# EAGLE design appleii (EAGLE 9.6.2)
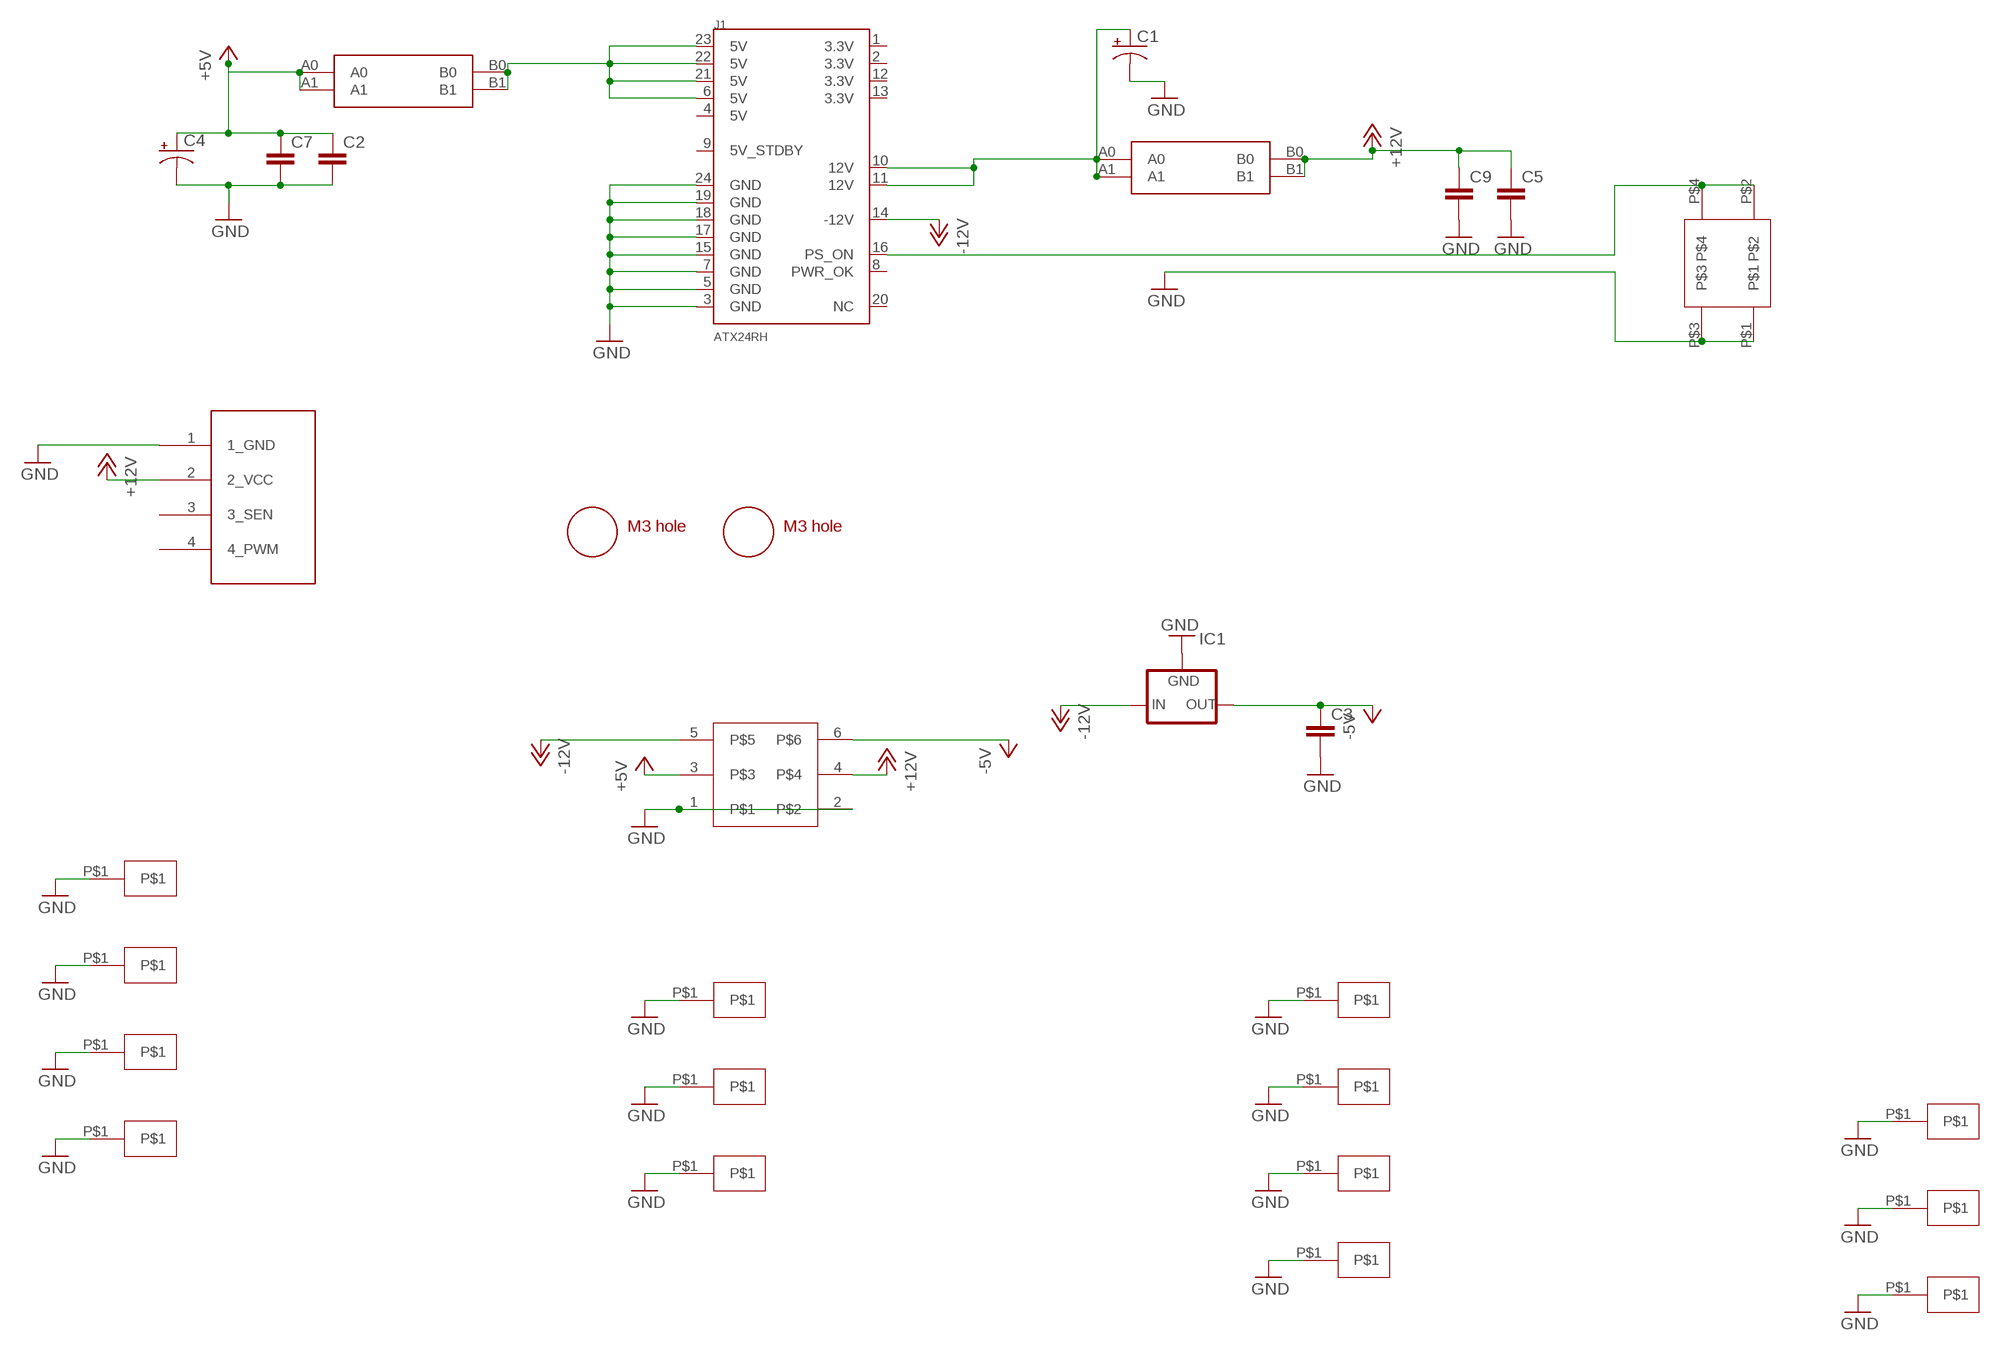
[diagram p0: schematic, sheet 1]

## Parts
C1  CPOL-USE3.5-8  [E3,5-8]
C2  C5/2.5  [C5B2.5]
C3  C5/2.5  [C5B2.5]
C4  CPOL-USE3.5-8  [E3,5-8]
C5  C5/2.5  [C5B2.5]
C7  C5/2.5  [C5B2.5]
C9  C5/2.5  [C5B2.5]
IC1  79XXS  [79XXS]
J1  ATX24RH  [ATX24_RIGHT_ANGLE]
JP3  4PIN_FAN  [1X04]
U$1  CAR_FUSE_HOLDER3IN1  [FUSE_HOLDER_3IN1]
U$2  CAR_FUSE_HOLDER3IN1  [FUSE_HOLDER_3IN1]
U$3  ROCK_SW  [ROCK_SWITCH]
U$4  M3_MOUNTING_HOLE  [M3_MOUNTING_HOLE_PACK]
U$5  M3_MOUNTING_HOLE  [M3_MOUNTING_HOLE_PACK]
U$6  APPLEII  [APPLEII]
U$7  EDGEPAD  [EDGEPAD]
U$8  EDGEPAD  [EDGEPAD]
U$9  EDGEPAD  [EDGEPAD]
U$10  EDGEPAD  [EDGEPAD]
U$11  EDGEPAD  [EDGEPAD]
U$12  EDGEPAD  [EDGEPAD]
U$13  EDGEPAD  [EDGEPAD]
U$14  EDGEPAD  [EDGEPAD]
U$15  EDGEPAD  [EDGEPAD]
U$16  EDGEPAD  [EDGEPAD]
U$17  EDGEPAD  [EDGEPAD]
U$18  EDGEPAD  [EDGEPAD]
U$19  EDGEPAD  [EDGEPAD]
U$20  EDGEPAD  [EDGEPAD]

## Nets
+5V: C2.1 C4.+ C7.1 U$1.A0 U$1.A1 U$6.3
+12V: C5.1 C9.1 JP3.2(2_VCC) U$2.B0 U$2.B1 U$6.4
-5V: C3.1 IC1.OUT U$6.6
-12V: IC1.IN J1.14(-12V) U$6.5
GND: C1.- C2.2 C3.2 C4.- C5.2 C7.2 C9.2 IC1.GND J1.3(GND) J1.5(GND) J1.7(GND) J1.15(GND) J1.17(GND) J1.18(GND) J1.19(GND) J1.24(GND) JP3.1(1_GND) U$3.P$1 U$3.P$3 U$6.1 U$6.2 U$7.P$1 U$8.P$1 U$9.P$1 U$10.P$1 U$11.P$1 U$12.P$1 U$13.P$1 U$14.P$1 U$15.P$1 U$16.P$1 U$17.P$1 U$18.P$1 U$19.P$1 U$20.P$1
N$5: J1.16(PS_ON) U$3.P$2 U$3.P$4
N$6: J1.6(5V) J1.21(5V) J1.22(5V) J1.23(5V) U$1.B0 U$1.B1
N$8: C1.+ J1.10(12V) J1.11(12V) U$2.A0 U$2.A1
Unconnected: J1.1(3.3V) J1.2(3.3V) J1.4(5V) J1.8(PWR_OK) J1.9(5V_STDBY) J1.12(3.3V) J1.13(3.3V) J1.20(NC) JP3.3(3_SEN) JP3.4(4_PWM)

## Library data of the parts
C1 C4 = adafruit_changed:CPOL-US: POLARIZED CAPACITOR, American symbol
C2 C3 C5 C7 C9 = capacitor-wima:C: CAPACITOR naming: grid - package width
IC1 = v-reg:79XXS: VOLTAGE REGULATOR
J1 = macse:ATX24: ATX24 Pin Power Supply Connector This is a good connector for connecting a computer power supply to a PCB. It's massive, but provides many amps of power at 5V and 12V. SKU: PRT-09498
JP3 = appleii:4PIN_FAN: PIN HEADER
U$1 U$2 = atx_power_control:CAR_FUSE_HOLDER
U$3 = atx4vc:ROCK_SW
U$4 U$5 = a:M3_MOUNTING_HOLE
U$6 = atx4vc:APPLEII
U$7-U$20 = atx4vc:EDGEPAD

## Board
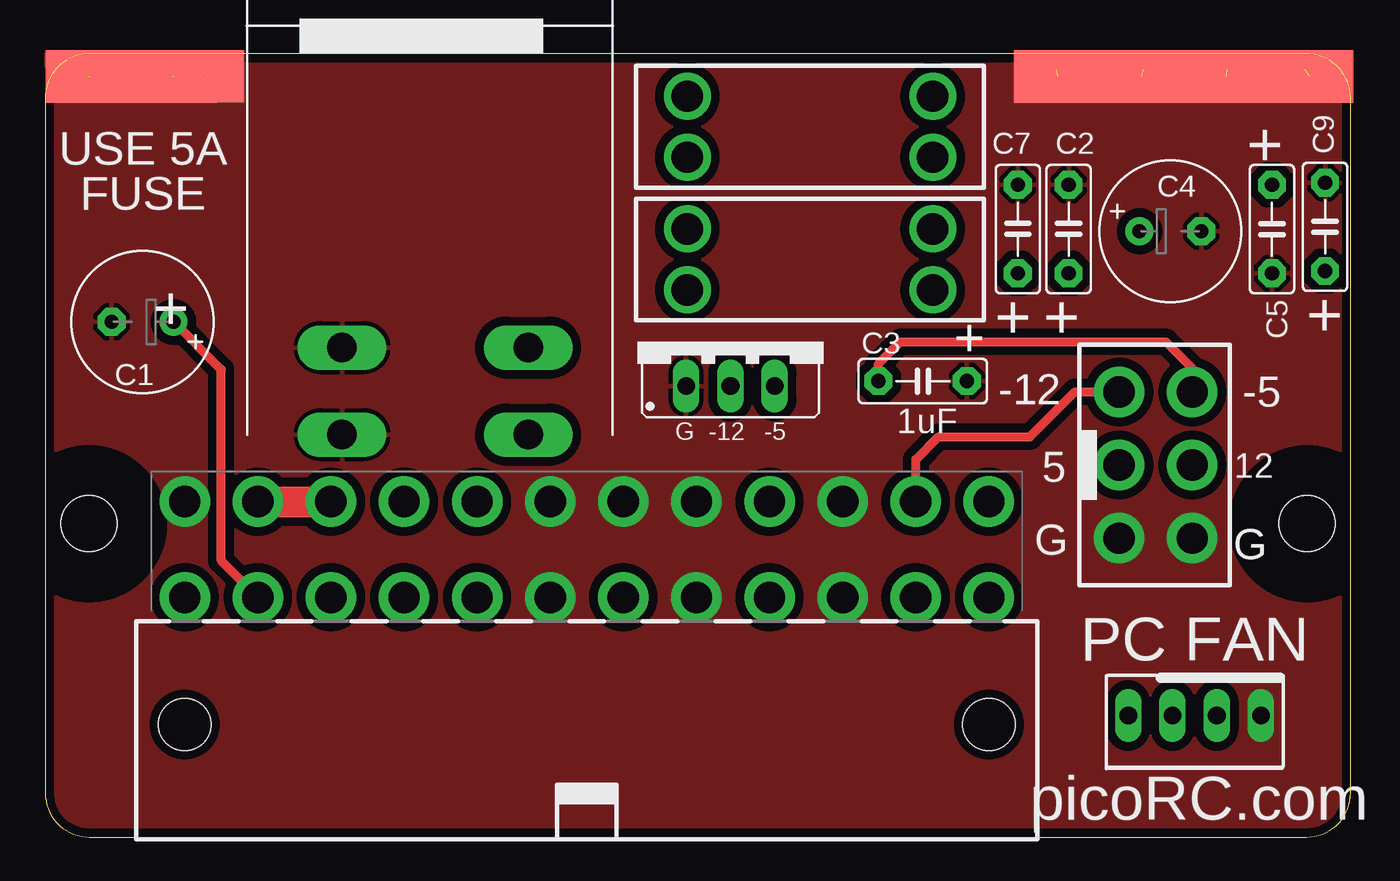
[diagram p1: board, top side]
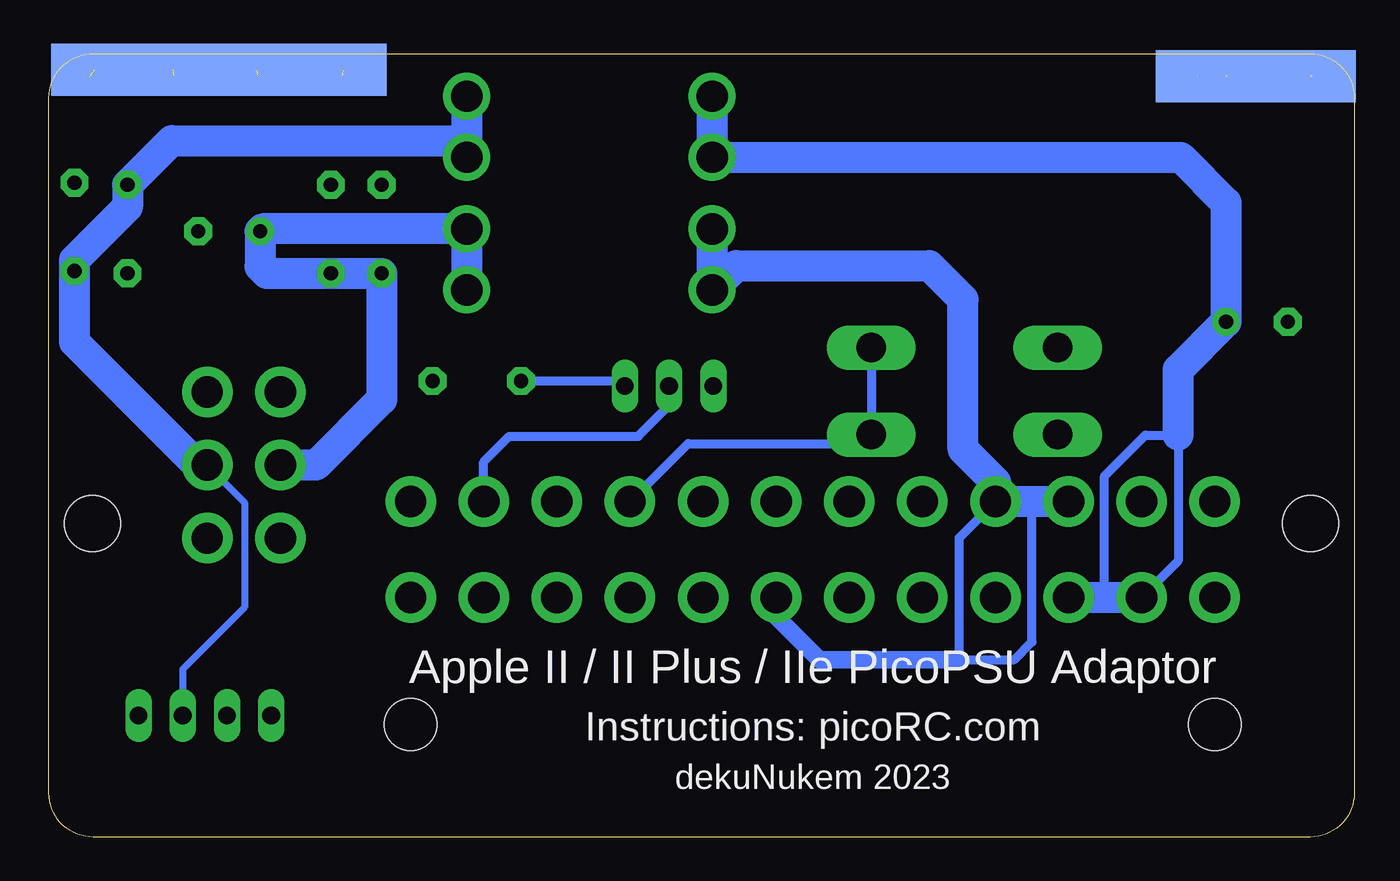
[diagram p2: board, bottom side, seen from below]

Size 75 x 45 mm. Coordinates in mm from the lower left corner, seen from the top.
Outline: 75,2.54 75,42.46 arc90 72.46,45 2.54,45 arc90 0,42.46 0,2.54 arc90 2.54,0 72.46,0 arc90 75,2.54
Copper layers (1*16): Top 0.035mm / dielectric 1.5mm / Bottom 0.035mm
Design rules "deku_2layer_6mil *": minimum track width 6mil, minimum drill 15mil, track to track 20mil, track to pad 6mil, pad to pad 6mil, via to via 6mil, smd to smd 6mil, copper to edge 10mil, drill to drill 6mil, minimum pad ring 7mil, minimum via ring 7mil, stop-mask expansion 4mil, vias tented up to drill 25mil, thermal gap 10mil
tRestrict: area -1.5,14 to 6.5,22; area 68.5,14 to 76.5,22

### Footprints (pad centres in the part's own frame; a part is rotated, then mirrored left to right if it is on the bottom)
E3,5-8 = drill 0.813 pad 1.6: + -1.778,0 | drill 0.813 pad 1.6 octagon: - 1.778,0
C5B2.5 = drill 0.813 pad 1.6 octagon: 1 -2.54,0; 2 2.54,0
79XXS = drill 1.016 long: GND -2.54,-2.54; IN 0,-2.54; OUT 2.54,-2.54
ATX24_RIGHT_ANGLE = drill 1.8 pad 2.9: 1 23.1,4.76; 2 18.9,4.76; 3 14.7,4.76; 4 10.5,4.76; 5 6.3,4.76; 6 2.1,4.76; 7 -2.1,4.76; 8 -6.3,4.76; 9 -10.5,4.76; 10 -14.7,4.76; 11 -18.9,4.76; 12 -23.1,4.76; 13 23.1,10.26; 14 18.9,10.26; 15 14.7,10.26; 16 10.5,10.26; 17 6.3,10.26; 18 2.1,10.26; 19 -2.1,10.26; 20 -6.3,10.26; 21 -10.5,10.26; 22 -14.7,10.26; 23 -18.9,10.26; 24 -23.1,10.26 | hole 3: -23.1,-2.54; 23.1,-2.54
1X04 = drill 1.016 long: 1 -3.81,0; 2 -1.27,0; 3 1.27,0; 4 3.81,0
FUSE_HOLDER_3IN1 = drill 1.8: A0 -7.05,1.75; A1 -7.05,-1.75; B0 7.05,1.75; B1 7.05,-1.75
ROCK_SWITCH = drill 1.7 long: P$1 -5.05,0; P$2 5.65,0; P$3 -5.05,5; P$4 5.65,5
M3_MOUNTING_HOLE_PACK = hole 3.2: 0,0
APPLEII = drill 1.8 pad 2.9: 1 4.2,-2.05; 2 4.2,2.15; 3 0,-2.05; 4 0,2.15; 5 -4.2,-2.05; 6 -4.2,2.15
EDGEPAD = smd 3 x 5: P$1 0,0

### Placement (x,y rotation side)
C1  5.59,29.59 180 top
C2  58.8,34.92 90 top
C3  50.42,26.19 0 top
C4  64.64,34.8 0 top
C5  70.48,34.92 270 top
C7  55.88,34.92 90 top
C9  73.53,35.05 90 top
IC1  39.37,28.45 0 top
J1  31.11,9.01 0 top
JP3  66.04,6.99 180 top
U$1  43.94,33.18 180 top
U$2  43.94,40.8 0 top
U$3  22.1,23.11 0 top
U$4  72.5,18 0 top
U$5  2.5,18 0 top
U$6  63.75,21.37 270 top
U$7  2.54,43.69 90 top
U$8  7.37,43.69 90 top
U$9  8.93,43.71 270 top
U$10  58.17,43.69 90 top
U$11  62.99,43.69 90 top
U$12  67.82,43.69 90 top
U$13  72.64,43.69 90 top
U$14  2.4,43.7 270 bottom
U$15  7.3,43.7 270 bottom
U$16  8.9,43.7 270 bottom
U$17  58.1,44.08 270 bottom
U$18  63.1,44.08 270 bottom
U$19  67.9,44.08 270 bottom
U$20  72.37,44.08 270 bottom

### Tracks (layer width: path | path; a pad name or v marks a point on that pad's centre or on a via)
+5V
  Bottom 1.778: U$1.A0 U$1.A1 62.73,34.93 C4.+ 62.87,32.77 62.48,32.38 C2.1 C7.1 55.88,25.15 59.66,21.37 U$6.3
+12V
  Bottom 0.406: U$6.4 63.75,19.22 63.75,13.21 67.31,9.65 JP3.2
  Bottom 1.778: U$2.B0 50.99,40.01 | 50.99,40.01 U$2.B1 | U$6.4 66.45,21.37 73.53,28.45 C9.1 73.53,33.15 70.48,36.2 C5.1 67.94,40.01 50.99,40.01
-5V
  Top 0.508: C3.1 47.88,27.18 49.15,28.45 64.39,28.45 65.9,26.93 U$6.6
  Bottom 0.508: IC1.OUT 42.2,26.19 C3.1
-12V
  Top 0.508: J1.14 50.02,21.68 51.32,22.99 56.58,22.99 59.16,25.57 U$6.5
  Bottom 0.508: J1.14 50.02,21.55 48.55,23.02 41.15,23.02 39.37,24.8 IC1.IN
GND  (7 unrouted)
  pour Top (isolate 0.508): 75,45 0,45 0,-0.06 75,-0.06
N$5
  Bottom 0.508: J1.16 38.28,22.61 28.26,22.61 U$3.P$2 U$3.P$4
N$6
  Top 1.778: J1.23 J1.22
  Bottom 0.508: J1.21 22.71,17.18 22.71,10.19 19.53,10.19 18.52,11.21 18.52,19.27
  Bottom 1.016: J1.6 33.22,12.67 30.73,10.19 22.71,10.19
  Bottom 1.778: J1.22 18.52,19.27 J1.21 20.61,20.4 22.48,22.27 22.48,30.89 24.41,32.83 35.49,32.83 U$1.B0 U$1.B1
N$8
  Top 0.508: J1.11 10.11,15.88 10.11,26.85 C1.+
  Bottom 0.508: J1.11 10.11,15.88 10.11,23.09 12,23.09 14.35,20.74 14.35,13.77
  Bottom 1.778: J1.10 14.35,13.77 J1.11 | U$2.A0 U$2.A1 9.97,39.05 7.37,36.45 C1.+ 10.11,26.85 10.11,23.09

### Text on the board
tNames: + | USE 5A / FUSE | + | + | + | + | + | -12 | -5 | 1uF | G | -12 | -5 | 5 | 12 | G | G | PC FAN | picoRC.com
bNames: Apple II / II Plus / IIe PicoPSU Adaptor | Instructions: picoRC.com | dekuNukem 2023